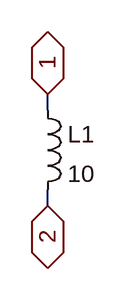
[diagram p0: schematic Motor.asc]
Motor.asc, the LTspice schematic file:
Version 4
SHEET 1 880 680
WIRE 208 144 208 128
WIRE 208 240 208 224
FLAG 208 128 1
IOPIN 208 128 BiDir
FLAG 208 240 2
IOPIN 208 240 BiDir
SYMBOL ind 192 128 R0
SYMATTR InstName L1
SYMATTR Value 10
SYMATTR SpiceLine Rser=10

The netlist it stands for:
* Motor.asc
L1 1 2 10 Rser=10
.backanno
.end